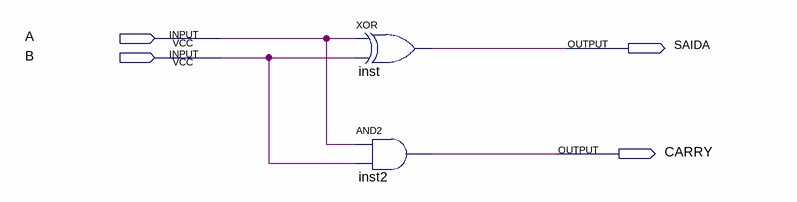
[diagram p0: schematic sheet]
// Quartus schematic Half-Adder.bdf as structural Verilog: 2 symbols, 4 pins
module \Half-Adder  (
  input  A,
  input  B,
  output SAIDA,
  output CARRY
);

  xor inst (SAIDA, A, B);
  and inst2 (CARRY, A, B);
endmodule
